# Altium schematic sheet DisplayPort Connector.SchDoc
size 209 x 297 mm; Author: ALTIUM GOSTBOM2.0 KEV; SheetNumber: 4; SheetTotal: 48
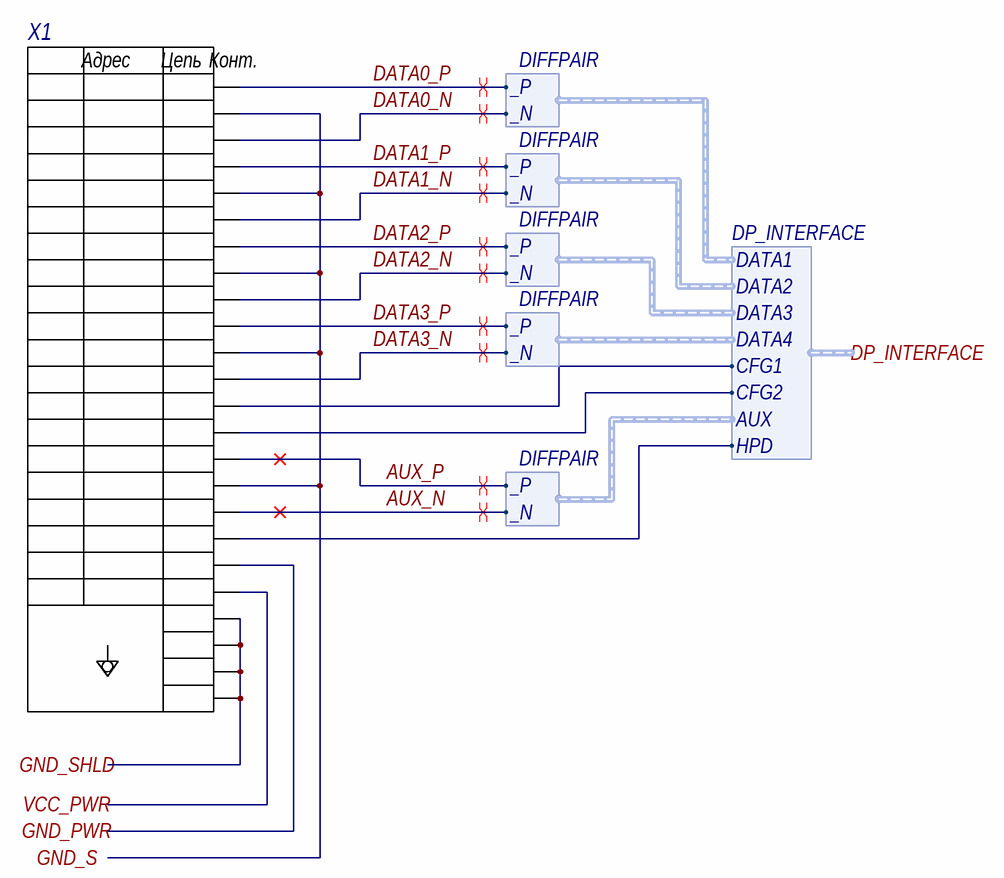
[diagram p0: DisplayPort Connector.SchDoc]

## Parts
X1  472720024  [MOLX-472720024_V]  (value not drawn)

## Ports
DP_INTERFACE (harness DP_INTERFACE), GND_PWR, GND_S, GND_SHLD, VCC_PWR

## Harnesses
DIFFPAIR: _P, _N
DP_INTERFACE: CFG1, DATA4, DATA3, DATA2, DATA1, CFG2, AUX, HPD

## Nets
AUX_N: X1.17 ; harness DIFFPAIR._N
AUX_P: X1.15 ; harness DIFFPAIR._P
DATA0_N: X1.3 ; harness DIFFPAIR._N
DATA0_P: X1.1 ; harness DIFFPAIR._P
DATA1_N: X1.6 ; harness DIFFPAIR._N
DATA1_P: X1.4 ; harness DIFFPAIR._P
DATA2_N: X1.9 ; harness DIFFPAIR._N
DATA2_P: X1.7 ; harness DIFFPAIR._P
DATA3_N: X1.12 ; harness DIFFPAIR._N
DATA3_P: X1.10 ; harness DIFFPAIR._P
GND_PWR: X1.19 ; port GND_PWR
GND_S: X1.2 X1.5 X1.8 X1.11 X1.16 ; port GND_S
GND_SHLD: X1.21(SHLD1) X1.22(SHLD2) X1.23(SHLD3) X1.24(SHLD4) ; port GND_SHLD
VCC_PWR: X1.20 ; port VCC_PWR
NetX1_13: X1.13 ; port DP_INTERFACE.CFG1
NetX1_14: X1.14 ; port DP_INTERFACE.CFG2
NetX1_18: X1.18 ; port DP_INTERFACE.HPD

## Layout directives
differential pair: AUX_N, AUX_P, DATA0_N, DATA0_P, DATA1_N, DATA1_P, DATA2_N, DATA2_P, DATA3_N, DATA3_P

## Notes on the sheet
- Подп. дата
- Инв. № дубл.
- Взам. инв. №
- Подп. и дата
- Инв. № подл.
- Изм.
- Лист
- № докум.
- Подп.
- Дата
- Файл:
- ALTIUM GOSTBOM2.0 KEV
- Копировал
- Формат А4
- (in symbol E34) Адрес; Цепь; Конт.

## Library data of the parts
X1 = E34: DisplayPort Connector, Pitch 0.5 mm, 1 x 20 Position, Height 6.65 mm, -20 to 85 degC, RoHS, Tape and Reel; Manufacturer: Molex; Тип элемента: Соединитель; Old_des: J6; New_des: X1; UID: E34; Component Kind: Standard; ComponentLink1Description: Manufacturer URL; ComponentLink1URL: http://www.molex.com/; ComponentLink2Description: Datasheet; ComponentLink2URL: http://www.molex.com/pdm_docs/sd/472720024_sd.pdf; DatasheetVersion: Rev. F; Mounting Technology: Surface Mount; PackageDescription: DisplayPort Connector, Pitch 0.5 mm, 1 x 20 Position, Height 6.65 mm; PartNumber: 472720024; PackageReference: 472720024; ClassName: A1